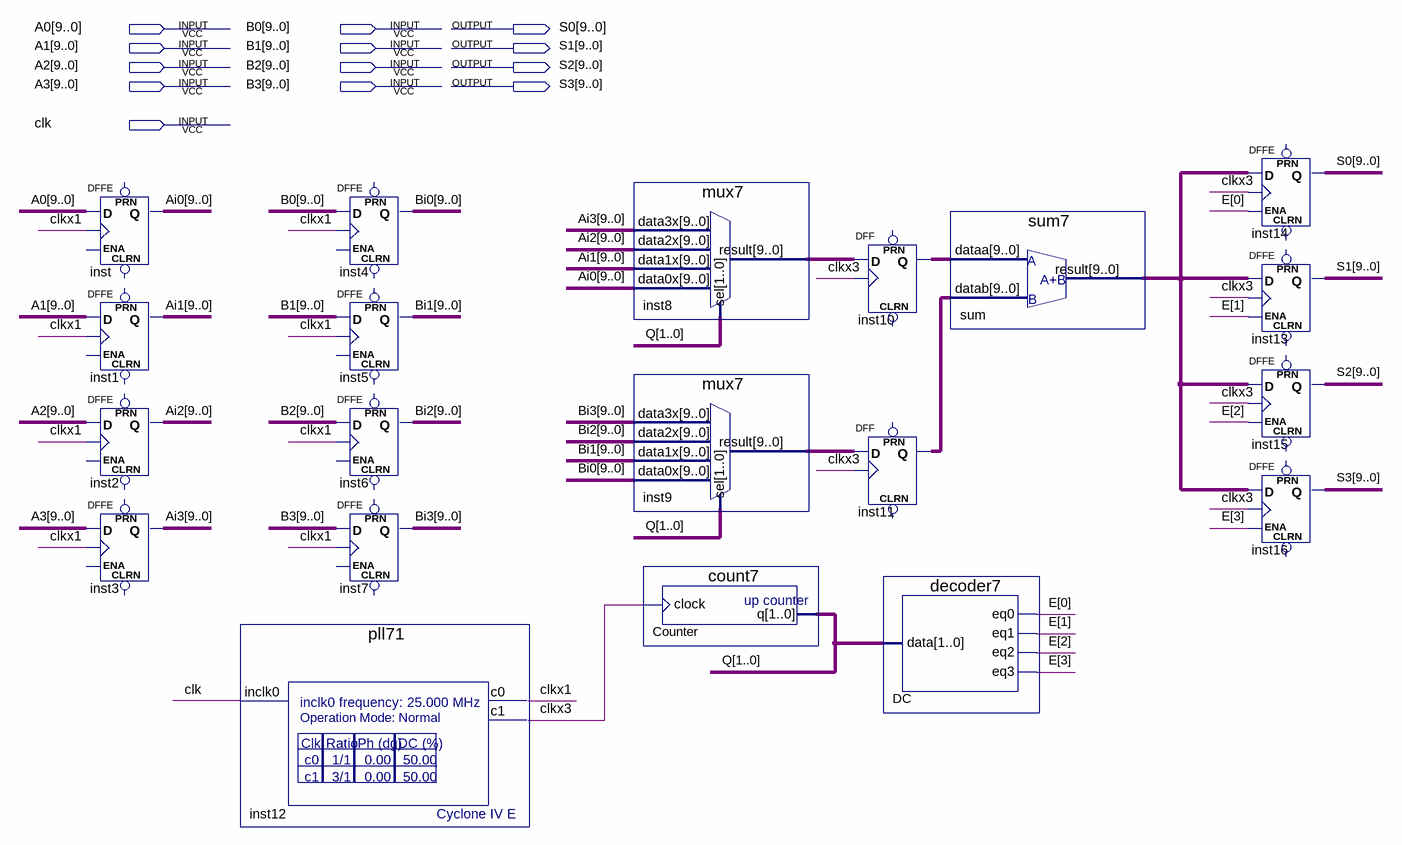
[diagram p0: schematic sheet]
// Quartus schematic b7.bdf as structural Verilog: 20 symbols, 13 pins
module b7 (
  input  [9:0] A0,
  input  [9:0] B0,
  input  [9:0] A1,
  input  [9:0] B1,
  input  [9:0] A2,
  input  [9:0] B2,
  input  [9:0] A3,
  input  [9:0] B3,
  input  clk,
  output [9:0] S0,
  output [9:0] S1,
  output [9:0] S2,
  output [9:0] S3
);

  wire clkx1, clkx3;
  wire [1:0] Q;
  wire [3:0] E;
  wire [9:0] Ai0, Ai1, Ai2, Ai3, Bi0, Bi1, Bi2, Bi3, inst8_result, inst9_result, inst10_q, inst11_q,
       sum_result;

  DFFE inst[9:0] (.D(A0), .CLK(clkx1), .Q(Ai0));  // open: PRN, CLRN, ENA
  DFFE inst1[9:0] (.D(A1), .CLK(clkx1), .Q(Ai1));  // open: PRN, CLRN, ENA
  DFFE inst2[9:0] (.D(A2), .CLK(clkx1), .Q(Ai2));  // open: PRN, CLRN, ENA
  DFFE inst3[9:0] (.D(A3), .CLK(clkx1), .Q(Ai3));  // open: PRN, CLRN, ENA
  pll71 inst12 (.inclk0(clk), .c0(clkx1), .c1(clkx3));
  DFFE inst4[9:0] (.D(B0), .CLK(clkx1), .Q(Bi0));  // open: PRN, CLRN, ENA
  DFFE inst5[9:0] (.D(B1), .CLK(clkx1), .Q(Bi1));  // open: PRN, CLRN, ENA
  DFFE inst6[9:0] (.D(B2), .CLK(clkx1), .Q(Bi2));  // open: PRN, CLRN, ENA
  DFFE inst7[9:0] (.D(B3), .CLK(clkx1), .Q(Bi3));  // open: PRN, CLRN, ENA
  mux7 inst8 (.data3x(Ai3), .data2x(Ai2), .data1x(Ai1), .data0x(Ai0), .sel(Q), .result(inst8_result));
  mux7 inst9 (.data3x(Bi3), .data2x(Bi2), .data1x(Bi1), .data0x(Bi0), .sel(Q), .result(inst9_result));
  count7 Counter (.clock(clkx3), .q(Q));
  DFF inst10[9:0] (.CLK(clkx3), .D(inst8_result), .Q(inst10_q));  // open: CLRN, PRN
  DFF inst11[9:0] (.CLK(clkx3), .D(inst9_result), .Q(inst11_q));  // open: CLRN, PRN
  decoder7 DC (.data(Q), .eq0(E[0]), .eq1(E[1]), .eq2(E[2]), .eq3(E[3]));
  sum7 sum (.dataa(inst10_q), .datab(inst11_q), .result(sum_result));
  DFFE inst14[9:0] (.D(sum_result), .CLK(clkx3), .ENA(E[0]), .Q(S0));  // open: PRN, CLRN
  DFFE inst13[9:0] (.D(sum_result), .CLK(clkx3), .ENA(E[1]), .Q(S1));  // open: PRN, CLRN
  DFFE inst15[9:0] (.D(sum_result), .CLK(clkx3), .ENA(E[2]), .Q(S2));  // open: PRN, CLRN
  DFFE inst16[9:0] (.D(sum_result), .CLK(clkx3), .ENA(E[3]), .Q(S3));  // open: PRN, CLRN
endmodule
